# Altium project SML_Control_board.PrjPcb (part 2 of 2)

## Sheet Ethernet.SchDoc
size 420 x 297 mm; Address1: Address1; Address2: Address2; Address3: Address3; Address4: Address4; DocumentNumber: *Э3; SheetNumber: 13; SheetTotal: 15; DocumentType: Схема электрическая *
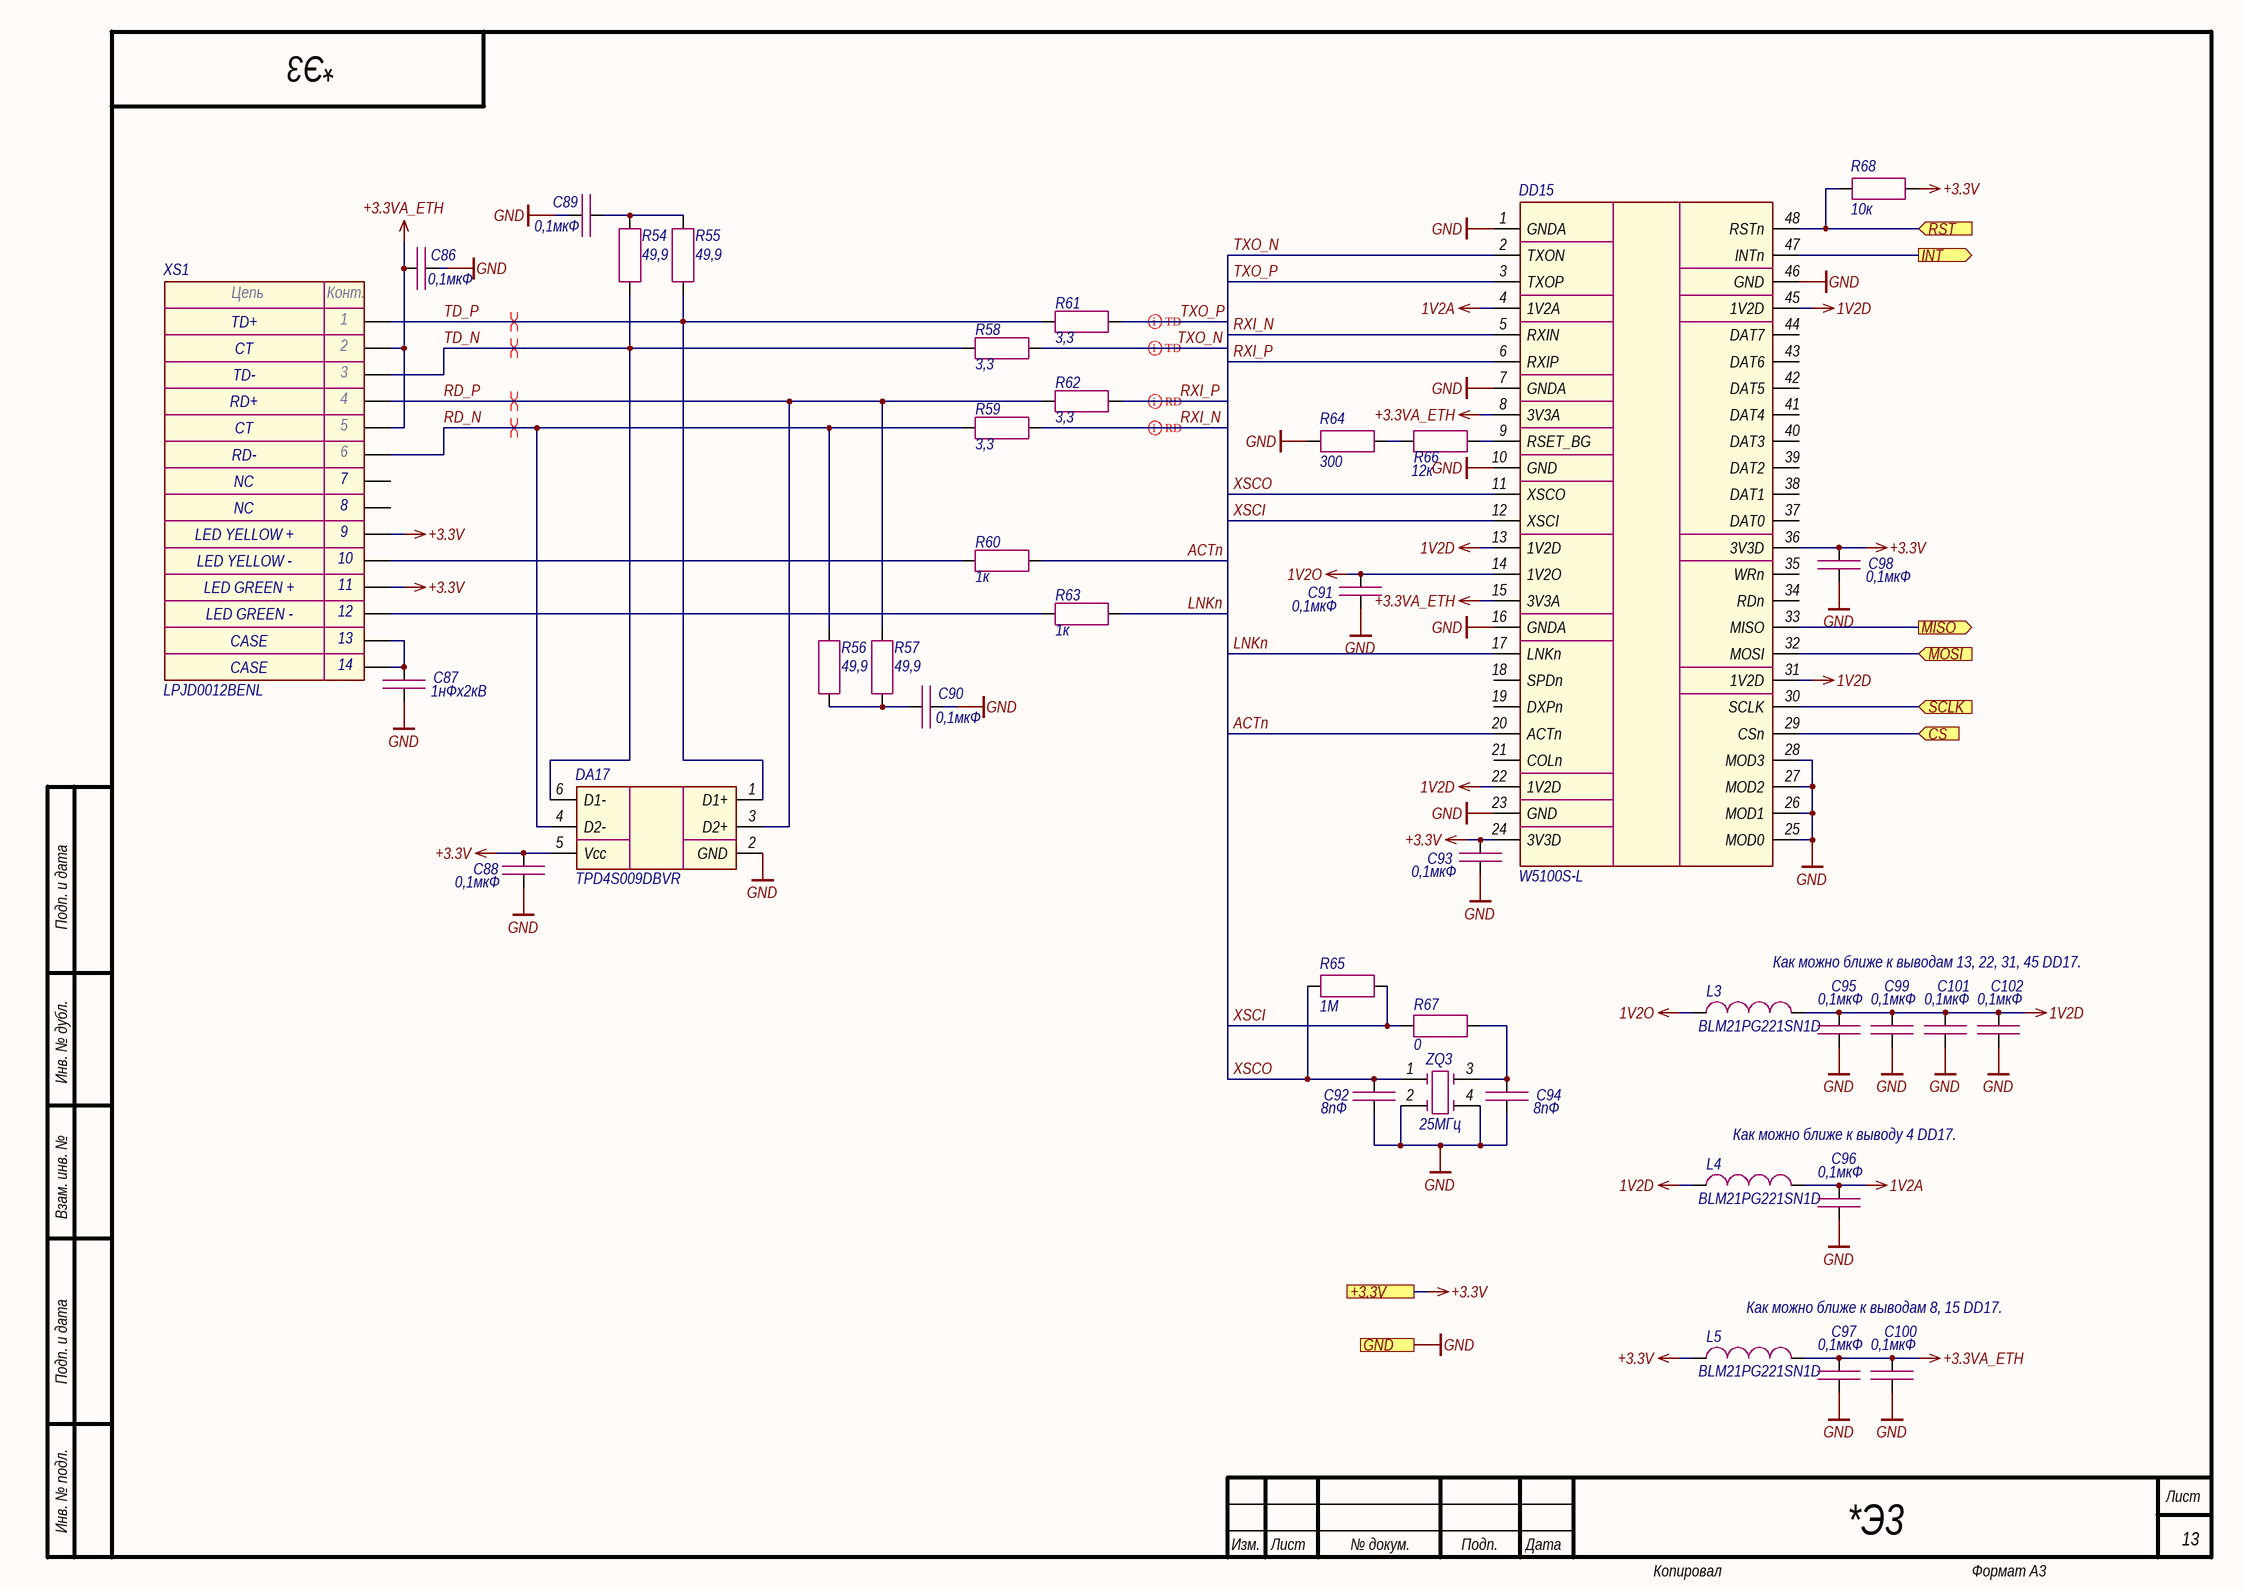
[diagram p12: Ethernet.SchDoc]

### Parts
C86  0,1мкФ  [CAP_0603]
C87  1нФх2кВ  [CAP_1206]
C88  0,1мкФ  [CAP_0603]
C89  0,1мкФ  [CAP_0603]
C90  0,1мкФ  [CAP_0603]
C91  0,1мкФ  [CAP_0603]
C92  8пФ  [CAP_0603]
C93  0,1мкФ  [CAP_0603]
C94  8пФ  [CAP_0603]
C95  0,1мкФ  [CAP_0603]
C96  0,1мкФ  [CAP_0603]
C97  0,1мкФ  [CAP_0603]
C98  0,1мкФ  [CAP_0603]
C99  0,1мкФ  [CAP_0603]
C100  0,1мкФ  [CAP_0603]
C101  0,1мкФ  [CAP_0603]
C102  0,1мкФ  [CAP_0603]
DA17  TPD4S009DBVR  [SOT-23-6]
DD15  W5100S-L  [LQFP-48]
L3  BLM21PG221SN1D  [IND_0805]
L4  BLM21PG221SN1D  [IND_0805]
L5  BLM21PG221SN1D  [IND_0805]
R54  49,9  [RES_0603]
R55  49,9  [RES_0603]
R56  49,9  [RES_0603]
R57  49,9  [RES_0603]
R58  3,3  [RES_0603]
R59  3,3  [RES_0603]
R60  1к  [RES_0603]
R61  3,3  [RES_0603]
R62  3,3  [RES_0603]
R63  1к  [RES_0603]
R64  300  [RES_0603]
R65  1М  [RES_0603]
R66  12к  [RES_0603]
R67  0  [RES_0603]
R68  10к  [RES_0603]
XS1  LPJD0012BENL  [LPJD0012BENL]
ZQ3  25МГц  [7M]

### Ports
+3.3V (see Main[1C], Button[1D], Fiber_interlock[2C], Flow_sensor[2C], Hardwiring[3D], LD_driver[1D], Power_supply[1D], Power_supply_CAN[1D], SF_driver[2C]), CS (in, see Main[1C]), GND (see Main[1C], Button[1D], Column[1C], Fiber_interlock[2C], Flow_sensor[2C], Guide_laser[1C], Hardwiring[3D], Indication[1C], LD_driver[1D], Power_supply[1D], Power_supply_CAN[1D], SF_driver[2D]), INT (out, see Main[1C]), MISO (out, see Main[1C]), MOSI (in, see Main[1C]), RST (in, see Main[1C]), SCLK (in, see Main[1C])

### Nets
1V2A: C96.1 DD15.4(1V2A) L4.2
1V2D: C95.1 C99.1 C101.1 C102.1 DD15.13(1V2D) DD15.22(1V2D) DD15.31(1V2D) DD15.45(1V2D) L3.2 L4.1
1V2O: C91.1 DD15.14(1V2O) L3.1
+3.3V: C88.1 C93.1 C98.1 DA17.5(Vcc) DD15.24(3V3D) DD15.36(3V3D) L5.1 R68.2 XS1.9 XS1.11 ; port +3.3V
+3.3VA_ETH: C86.1 C97.1 C100.1 DD15.8(3V3A) DD15.15(3V3A) L5.2 XS1.2 XS1.5
GND: C86.2 C87.2 C88.2 C89.2 C90.2 C91.2 C92.2 C93.2 C94.2 C95.2 C96.2 C97.2 C98.2 C99.2 C100.2 C101.2 C102.2 DA17.2(GND) DD15.1(GNDA) DD15.7(GNDA) DD15.10(GND) DD15.16(GNDA) DD15.23(GND) DD15.25(MOD0) DD15.26(MOD1) DD15.27(MOD2) DD15.28(MOD3) DD15.46(GND) R64.1 ZQ3.2 ZQ3.4 ; port GND
ACTn: DD15.20(ACTn) R60.2
ETH_CS: DD15.29(CSn) ; port CS
ETH_INT: DD15.47(INTn) ; port INT
ETH_MISO: DD15.33(MISO) ; port MISO
ETH_MOSI: DD15.32(MOSI) ; port MOSI
ETH_RST: DD15.48(RSTn) R68.1 ; port RST
ETH_SCLK: DD15.30(SCLK) ; port SCLK
LNKn: DD15.17(LNKn) R63.2
RD_N: DA17.4(D2-) R56.1 R59.2 XS1.6
RD_P: DA17.3(D2+) R57.1 R62.2 XS1.4
RXI_N: DD15.5(RXIN) R59.1
RXI_P: DD15.6(RXIP) R62.1
TD_N: DA17.6(D1-) R54.1 R58.2 XS1.3
TD_P: DA17.1(D1+) R55.1 R61.2 XS1.1
TXO_N: DD15.2(TXON) R58.1
TXO_P: DD15.3(TXOP) R61.1
XSCI: DD15.12(XSCI) R65.2 R67.1
XSCO: C92.1 DD15.11(XSCO) R65.1 ZQ3.1
NetC87_1: C87.1 XS1.13 XS1.14
NetC89_1: C89.1 R54.2 R55.2
NetC90_1: C90.1 R56.2 R57.2
NetC94_1: C94.1 R67.2 ZQ3.3
NetDD15_9: DD15.9(RSET_BG) R66.2
NetR60_1: R60.1 XS1.10
NetR63_1: R63.1 XS1.12
NetR64_2: R64.2 R66.1

Not connected (* = marked no-connect by the designer): DD15 18(SPDn) 19(DXPn) 21(COLn) 34(RDn) 35(WRn) 37(DAT0) 38(DAT1) 39(DAT2) 40(DAT3) 41(DAT4) 42(DAT5) 43(DAT6) 44(DAT7); XS1 7 8

### Layout directives
differential pair; differential pair class TD: TXO_N, TXO_P
differential pair; differential pair class RD: RXI_N, RXI_P
differential pair: RD_N, RD_P, TD_N, TD_P

### Notes on the sheet
- Как можно ближе к выводам 13, 22, 31, 45 DD17.
- Как можно ближе к выводу 4 DD17.
- Как можно ближе к выводам 8, 15 DD17.
- Подп. и дата
- Инв. № дубл.
- Взам. инв. №
- Инв. № подл.
- Изм.
- Лист
- № докум.
- Подп.
- Дата
- Копировал
- Формат А3
- (in symbol LPJD0012BENL) Цепь; Конт.; TD+; CT; TD-; RD+; RD-; NC; LED YELLOW +; LED YELLOW -; LED GREEN +; LED GREEN -; CASE

### Library data of the parts
C86 C88-C91 C93 C95-C102 = Capacitor: as C3 on sheet Main; Value: 0,1мкФ; Document: *
C87 = Capacitor: Manufacturer: Yageo; Model: CC1206KKX7RDBB102; Value: 1нФх2кВ; Document: *
C92 C94 = Capacitor: Manufacturer: Yageo; Model: CC0603CRNPO9BN8R0; Value: 8пФ; Document: *
DA17 = TPD4S009: Manufacturer: Texas Instruments; Model: TPD4S009DBVR; Document: *
DD15 = W5100S: Manufacturer: Wiznet; Model: W5100S-L; Document: *
L3-L5 = Inductor: Manufacturer: Murata; Value: *; Model: BLM21PG221SN1D; Document: *
R54-R57 = Resistor: Manufacturer: Yageo; Model: RC0603FR-0749R9L; Value: 49,9; Document: *
R58 R59 R61 R62 = Resistor: Manufacturer: Yageo; Model: RC0603FR-073R3L; Value: 3,3; Document: *
R60 R63 = Resistor: Manufacturer: Yageo; Model: RC0603FR-071KL; Value: 1к; Document: *
R64 = Resistor: Manufacturer: Yageo; Model: RC0603FR-07300RL; Value: 300; Document: *
R65 = Resistor: Manufacturer: Yageo; Model: RC0603FR-071ML; Value: 1М; Document: *
R66 = Resistor: Manufacturer: Yageo; Model: RC0603FR-0712KL; Value: 12к; Document: *
R67 = Resistor: Manufacturer: Yageo; Model: RC0603JR-070RL; Value: 0; Document: *
R68 = Resistor: as R3 on sheet Main; Value: 10к; Document: *
XS1 = LPJD0012BENL: Manufacturer: LINK-PP; Model: LPJD0012BENL; Document: *
ZQ3 = Quartz_Resonator_4-pin: Manufacturer: TXC; Model: 7M-25.000MAAJ-T; Value: 25МГц; Document: *

## Sheet Hardwiring.SchDoc
size 594 x 420 mm; Address1: Address1; Address2: Address2; Address3: Address3; Address4: Address4; DocumentNumber: *Э3; SheetNumber: 14; SheetTotal: 15; DocumentType: Схема электрическая *
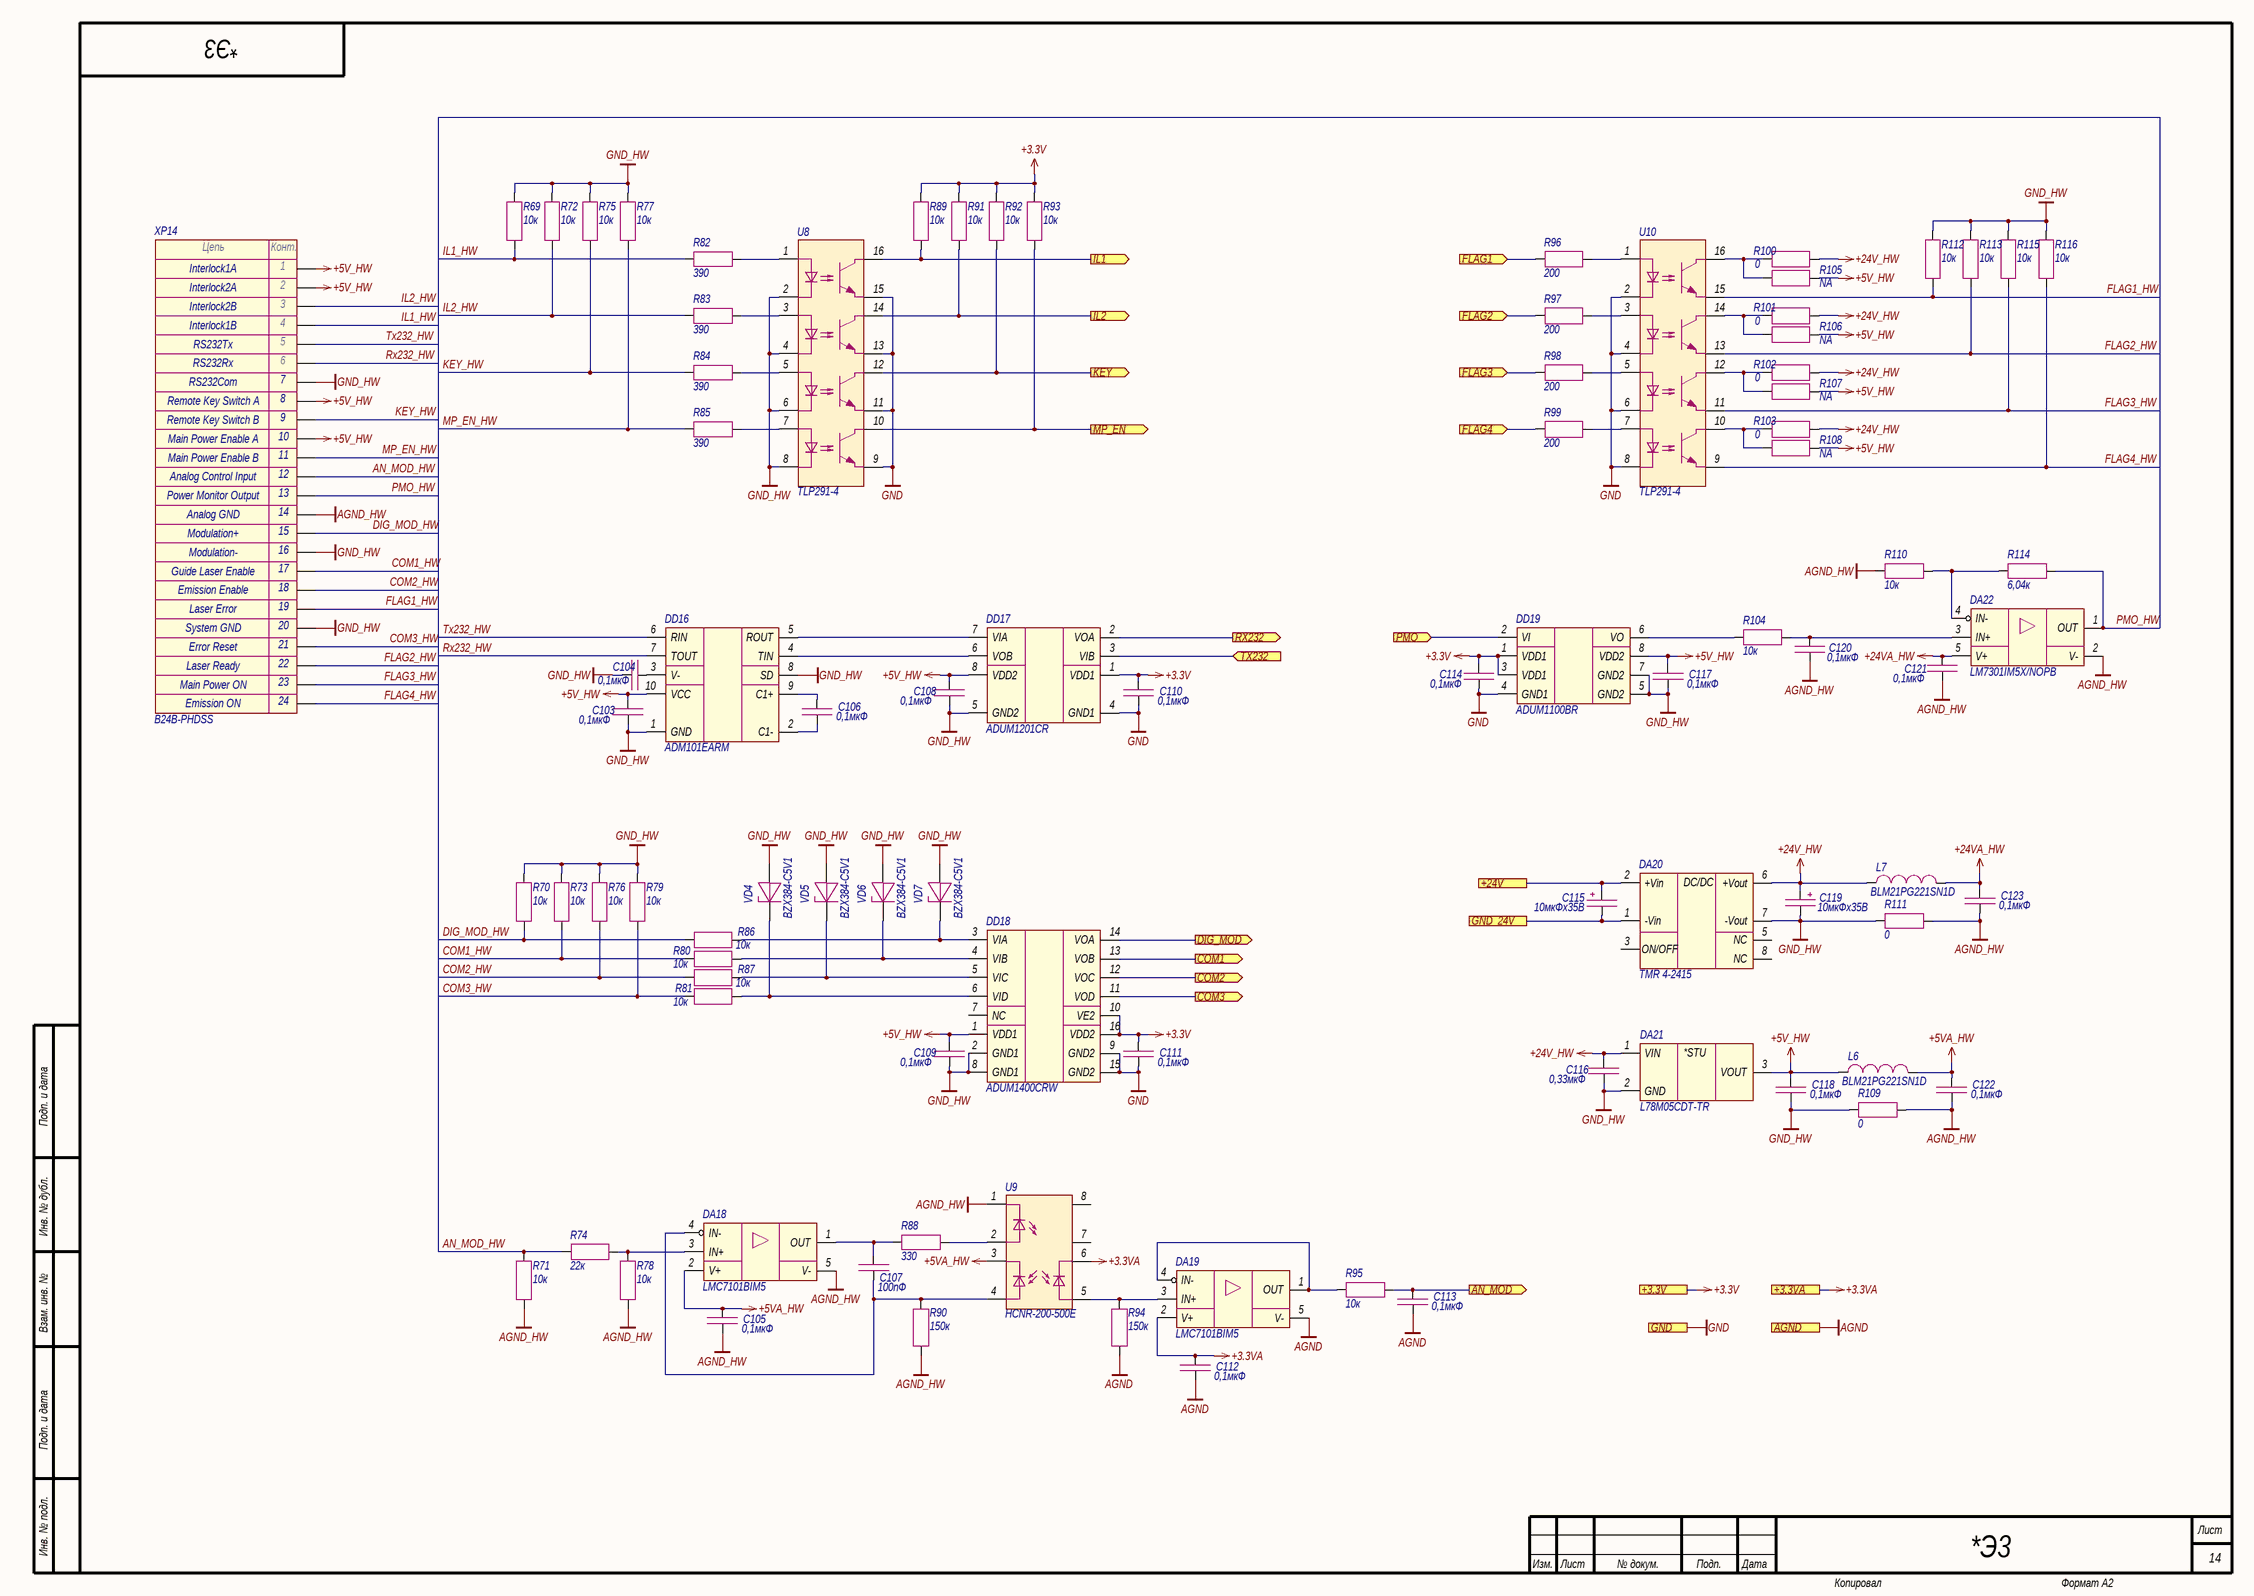
[diagram p13: Hardwiring.SchDoc]

### Parts
C103  0,1мкФ  [CAP_0603]
C104  0,1мкФ  [CAP_0603]
C105  0,1мкФ  [CAP_0603]
C106  0,1мкФ  [CAP_0603]
C107  100пФ  [CAP_0603]
C108  0,1мкФ  [CAP_0603]
C109  0,1мкФ  [CAP_0603]
C110  0,1мкФ  [CAP_0603]
C111  0,1мкФ  [CAP_0603]
C112  0,1мкФ  [CAP_0603]
C113  0,1мкФ  [CAP_0603]
C114  0,1мкФ  [CAP_0603]
C115  10мкФх35B  [CAP_C]
C116  0,33мкФ  [CAP_0805]
C117  0,1мкФ  [CAP_0603]
C118  0,1мкФ  [CAP_0603]
C119  10мкФх35B  [CAP_C]
C120  0,1мкФ  [CAP_0603]
C121  0,1мкФ  [CAP_0603]
C122  0,1мкФ  [CAP_0603]
C123  0,1мкФ  [CAP_0603]
DA18  LMC7101BIM5  [SOT-23-5]
DA19  LMC7101BIM5  [SOT-23-5]
DA20  TMR 4-2415  [TMR4 (SIP-8)]
DA21  L78M05CDT-TR  [TO-252]
DA22  LM7301IM5X/NOPB  [SOT-23-5]
DD16  ADM101EARM  [MSOP-10]
DD17  ADUM1201CR  [SOIC-8]
DD18  ADUM1400CRW  [SOIC-16W]
DD19  ADUM1100BR  [SOIC-8]
L6  BLM21PG221SN1D  [IND_0805]
L7  BLM21PG221SN1D  [IND_0805]
R69  10к  [RES_0603]
R70  10к  [RES_0603]
R71  10к  [RES_0603]
R72  10к  [RES_0603]
R73  10к  [RES_0603]
R74  22к  [RES_0603]
R75  10к  [RES_0603]
R76  10к  [RES_0603]
R77  10к  [RES_0603]
R78  10к  [RES_0603]
R79  10к  [RES_0603]
R80  10к  [RES_0603]
R81  10к  [RES_0603]
R82  390  [RES_0603]
R83  390  [RES_0603]
R84  390  [RES_0603]
R85  390  [RES_0603]
R86  10к  [RES_0603]
R87  10к  [RES_0603]
R88  330  [RES_0603]
R89  10к  [RES_0603]
R90  150к  [RES_0603]
R91  10к  [RES_0603]
R92  10к  [RES_0603]
R93  10к  [RES_0603]
R94  150к  [RES_0603]
R95  10к  [RES_0603]
R96  200  [RES_0603]
R97  200  [RES_0603]
R98  200  [RES_0603]
R99  200  [RES_0603]
R100  0  [RES_0603]
R101  0  [RES_0603]
R102  0  [RES_0603]
R103  0  [RES_0603]
R104  10к  [RES_0603]
R105  NA  [RES_0603]
R106  NA  [RES_0603]
R107  NA  [RES_0603]
R108  NA  [RES_0603]
R109  0  [RES_0805]
R110  10к  [RES_0603]
R111  0  [RES_0805]
R112  10к  [RES_0603]
R113  10к  [RES_0603]
R114  6,04к  [RES_0603]
R115  10к  [RES_0603]
R116  10к  [RES_0603]
U8  TLP291-4  [SOP-16]
U9  HCNR-200-500E  [HCNR200]
U10  TLP291-4  [SOP-16]
VD4  BZX384-C5V1  [SOD-323]
VD5  BZX384-C5V1  [SOD-323]
VD6  BZX384-C5V1  [SOD-323]
VD7  BZX384-C5V1  [SOD-323]
XP14  B24B-PHDSS  [B24B-PHDSS]

### Ports
+3.3V (see Main[1D], Button[1D], Ethernet[3D], Fiber_interlock[2C], Flow_sensor[2C], LD_driver[1D], Power_supply[1D], Power_supply_CAN[1D], SF_driver[2C]), +3.3VA (see Main[1D], Photodiode[1C], Thermistor[2C]), +24V (see Main[1D], Button[1C], Column[1C], Flow_sensor[2C], Indication[1C], LD_driver[1C], Power_supply[1D], Power_supply_CAN[1D]), AGND (see Main[1D], Photodiode[1C], Thermistor[2C]), AN_MOD (out, see Main[1D]), COM1 (out, see Main[1D]), COM2 (out, see Main[1D]), COM3 (out, see Main[1D]), DIG_MOD (out, see Main[1C]), FLAG1 (in, see Main[1C]), FLAG2 (in, see Main[1C]), FLAG3 (in, see Main[1C]), FLAG4 (in, see Main[1C]), GND (see Main[1D], Button[1D], Column[1C], Ethernet[3D], Fiber_interlock[2C], Flow_sensor[2C], Guide_laser[1C], Indication[1C], LD_driver[1D], Power_supply[1D], Power_supply_CAN[1D], SF_driver[2D]), GND_24V (see Main[1D], Button[1D], Column[1C], Flow_sensor[2C], Indication[1C], LD_driver[1D], Power_supply[1D], Power_supply_CAN[1D]), IL1 (out, see Main[1C]), IL2 (out, see Main[1C]), KEY (out, see Main[1C]), MP_EN (out, see Main[1C]), PMO (in, see Main[1C]), RX232 (out, see Main[1D]), TX232 (in, see Main[1D])

### Nets
+3.3V: C110.1 C111.1 C114.1 DD17.1(VDD1) DD18.10(VE2) DD18.16(VDD2) DD19.1(VDD1) DD19.3(VDD1) R89.1 R91.1 R92.1 R93.1 ; port +3.3V
+3.3VA: C112.1 DA19.2(V+) U9.6 ; port +3.3VA
+5V_HW: C103.1 C108.1 C109.1 C117.1 C118.1 DA21.3(VOUT) DD16.10(VCC) DD17.8(VDD2) DD18.1(VDD1) DD19.8(VDD2) L6.1 R105.2 R106.2 R107.2 R108.2 XP14.1 XP14.2 XP14.8 XP14.10
+5VA_HW: C105.1 C122.1 DA18.2(V+) L6.2 U9.3
+24V: C115.1 DA20.2(+Vin) ; port +24V
+24V_HW: C116.2 C119.1 DA20.6(+Vout) DA21.1(VIN) L7.1 R100.2 R101.2 R102.2 R103.2
+24VA_HW: C121.1 C123.1 DA22.5(V+) L7.2
AGND: C112.2 C113.2 DA19.5(V-) R94.2 ; port AGND
AGND_HW: C105.2 C120.2 C121.2 C122.2 C123.2 DA18.5(V-) DA22.2(V-) R71.2 R78.2 R90.2 R109.2 R110.1 R111.2 U9.1 XP14.14
GND: C110.2 C111.2 C114.2 DD17.4(GND1) DD18.9(GND2) DD18.15(GND2) DD19.4(GND1) U8.9 U8.11 U8.13 U8.15 U10.2 U10.4 U10.6 U10.8 ; port GND
GND_24V: C115.2 DA20.1(-Vin) ; port GND_24V
GND_HW: C103.2 C104.2 C108.2 C109.2 C116.1 C117.2 C118.2 C119.2 DA20.7(-Vout) DA21.2(GND) DD16.1(GND) DD16.8(SD) DD17.5(GND2) DD18.2(GND1) DD18.8(GND1) DD19.5(GND2) DD19.7(GND2) R69.1 R70.1 R72.1 R73.1 R75.1 R76.1 R77.1 R79.1 R109.1 R111.1 R112.1 R113.1 R115.1 R116.1 U8.2 U8.4 U8.6 U8.8 VD4.2(A) VD5.2(A) VD6.2(A) VD7.2(A) XP14.7 XP14.16 XP14.20
AN_MOD_HW: R71.1 R74.1 XP14.12
COM1_HW: R73.2 R80.1 XP14.17
COM2_HW: R76.2 R87.1 XP14.18
COM3_HW: R79.2 R81.1 XP14.21
DIG_MOD_HW: R70.2 R86.1 XP14.15
EXT_AN_MOD: C113.1 R95.2 ; port AN_MOD
EXT_COM1: DD18.13(VOB) ; port COM1
EXT_COM2: DD18.12(VOC) ; port COM2
EXT_COM3: DD18.11(VOD) ; port COM3
EXT_DIG_MOD: DD18.14(VOA) ; port DIG_MOD
EXT_FLAG1: R96.2 ; port FLAG1
EXT_FLAG2: R97.2 ; port FLAG2
EXT_FLAG3: R98.2 ; port FLAG3
EXT_FLAG4: R99.2 ; port FLAG4
EXT_IL1: R89.2 U8.16 ; port IL1
EXT_IL2: R91.2 U8.14 ; port IL2
EXT_KEY: R92.2 U8.12 ; port KEY
EXT_MP_EN: R93.2 U8.10 ; port MP_EN
EXT_PMO: DD19.2(VI) ; port PMO
FLAG1_HW: R112.2 U10.15 XP14.19
FLAG2_HW: R113.2 U10.13 XP14.22
FLAG3_HW: R115.2 U10.11 XP14.23
FLAG4_HW: R116.2 U10.9 XP14.24
IL1_HW: R69.2 R82.1 XP14.4
IL2_HW: R72.2 R83.1 XP14.3
KEY_HW: R75.2 R84.1 XP14.9
MP_EN_HW: R77.2 R85.1 XP14.11
PMO_HW: DA22.1(OUT) R114.2 XP14.13
Rx232: DD17.2(VOA) ; port RX232
Rx232_HW: DD16.7(TOUT) XP14.6
Tx232: DD17.3(VIB) ; port TX232
Tx232_HW: DD16.6(RIN) XP14.5
NetC104_1: C104.1 DD16.3(V-)
NetC106_1: C106.1 DD16.9(C1+)
NetC106_2: C106.2 DD16.2(C1-)
NetC107_1: C107.1 DA18.1(OUT) R88.1
NetC107_2: C107.2 DA18.4(IN-) R90.1 U9.4
NetC120_1: C120.1 DA22.3(IN+) R104.2
NetDA18_3: DA18.3(IN+) R74.2 R78.1
NetDA19_1: DA19.1(OUT) DA19.4(IN-) R95.1
NetDA19_3: DA19.3(IN+) R94.1 U9.5
NetDA22_4: DA22.4(IN-) R110.2 R114.1
NetDD16_4: DD16.4(TIN) DD17.6(VOB)
NetDD16_5: DD16.5(ROUT) DD17.7(VIA)
NetDD18_3: DD18.3(VIA) R86.2 VD7.1(K)
NetDD18_4: DD18.4(VIB) R80.2 VD6.1(K)
NetDD18_5: DD18.5(VIC) R87.2 VD5.1(K)
NetDD18_6: DD18.6(VID) R81.2 VD4.1(K)
NetDD19_6: DD19.6(VO) R104.1
NetR82_2: R82.2 U8.1
NetR83_2: R83.2 U8.3
NetR84_2: R84.2 U8.5
NetR85_2: R85.2 U8.7
NetR88_2: R88.2 U9.2
NetR96_1: R96.1 U10.1
NetR97_1: R97.1 U10.3
NetR98_1: R98.1 U10.5
NetR99_1: R99.1 U10.7
NetR100_1: R100.1 R105.1 U10.16
NetR101_1: R101.1 R106.1 U10.14
NetR102_1: R102.1 R107.1 U10.12
NetR103_1: R103.1 R108.1 U10.10

Not connected (* = marked no-connect by the designer): DA20 3(ON/OFF) 5(NC) 8(NC); DD18 7(NC); U9 7 8

### Notes on the sheet
- Interlock1A
- Interlock2A
- Interlock2B
- Interlock1B
- RS232Tx
- RS232Rx
- RS232Com
- (near XP14) Remote Key Switch A
- (near XP14) Remote Key Switch B
- (near XP14) Main Power Enable A
- (near XP14) Main Power Enable B
- (near XP14) Analog Control Input
- (near XP14) Power Monitor Output
- Analog GND
- Modulation+
- Modulation-
- (near XP14) Guide Laser Enable
- (near XP14) Emission Enable
- System GND
- Error Reset
- Laser Error
- Main Power ON
- Emission ON
- Laser Ready
- Подп. и дата
- Инв. № дубл.
- Взам. инв. №
- Инв. № подл.
- Изм.
- Лист
- № докум.
- Подп.
- Дата
- Копировал
- Формат А2
- (in symbol Connector-24) Цепь; Конт.
- (in symbol L78M) *STU
- (in symbol TMR4) DC/DC

### Library data of the parts
C103-C106 C108-C114 C117 C118 C120-C123 = Capacitor: Manufacturer: Murata; Model: GRM188R71H104KA93D; Value: 0,1мкФ; Document: *
C107 = Capacitor: Manufacturer: Murata; Model: GRM1885C1H101JA01D; Value: 100пФ; Document: *
C115 C119 = Capacitor_Polar: Model: TECAP, 10 мкФ, 35 В, тип C, 10%; Value: 10мкФх35B; Document: *; Manufacturer: *
C116 = Capacitor: Manufacturer: Murata; Model: GRM219R71H334KA88D; Value: 0,33мкФ; Document: *
DA18 DA19 = LMC7101: Manufacturer: Texas Instruments; Model: LMC7101BIM5; Document: *
DA20 = TMR4: Manufacturer: Traco Power; Model: TMR 4-2415; Document: *
DA21 = L78M: Manufacturer: STMicroelectronics; Model: L78M05CDT-TR; Document: *
DA22 = LM7301IM5: Manufacturer: Texas Instruments; Model: LM7301IM5X/NOPB; Document: *
DD16 = ADM101EARM: Manufacturer: Analog Devices; Model: ADM101EARM; Document: *
DD17 = ADUM1201: Manufacturer: Analog Devices; Model: ADUM1201CR; Document: *
DD18 = ADUM1400: Manufacturer: Analog Devices; Model: ADUM1400CRW; Document: *
DD19 = ADUM1100: Manufacturer: Analog Devices; Model: ADUM1100BR; Document: *
L6 L7 = Inductor: Manufacturer: Murata; Value: *; Model: BLM21PG221SN1D; Document: *
R69-R73 R75-R81 R86 R87 R89 R91-R93 R95 R104 R110 R112 R113 R115 R116 = Resistor: Manufacturer: Yageo; Model: RC0603FR-0710KL; Value: 10к; Document: *
R74 = Resistor: Manufacturer: Yageo; Model: RC0603FR-0722KL; Value: 22к; Document: *
R82-R85 = Resistor: Manufacturer: Yageo; Model: RC0603FR-07390RL; Value: 390; Document: *
R88 = Resistor: Manufacturer: Yageo; Model: RC0603FR-07330RL; Value: 330; Document: *
R90 R94 = Resistor: Manufacturer: Yageo; Model: RC0603FR-07150KL; Value: 150к; Document: *
R96-R99 = Resistor: Manufacturer: Yageo; Model: RC0603FR-07200RL; Value: 200; Document: *
R100-R103 = Resistor: Manufacturer: Yageo; Model: RC0603FR-070RL; Value: 0; Document: *
R105-R108 = Resistor: Value: NA; Model: *; Document: *; Manufacturer: *
R109 R111 = Resistor: Manufacturer: Yageo; Model: RC0805FR-070RL; Value: 0; Document: *
R114 = Resistor: Manufacturer: Yageo; Model: RC0603FR-076K04L; Value: 6,04к; Document: *
U8 U10 = TLP281-4: Manufacturer: Toshiba; Model: TLP291-4; Document: *
U9 = HCNR200: Manufacturer: Avago; Model: HCNR-200-500E; Document: *
VD4-VD7 = Diode_Zener: Manufacturer: Nexperia; Model: BZX384-C5V1; Document: *
XP14 = Connector-24: Manufacturer: JST; Model: B24B-PHDSS; Document: *

## Sheet SF_driver.SchDoc
size 420 x 297 mm; Address1: Address1; Address2: Address2; Address3: Address3; Address4: Address4; DocumentNumber: *Э3; SheetNumber: 15; SheetTotal: 15; DocumentType: Схема электрическая *
Used 2 times, as channels A25, A26. Parts and nets are listed once, with the designators drawn on the sheet.
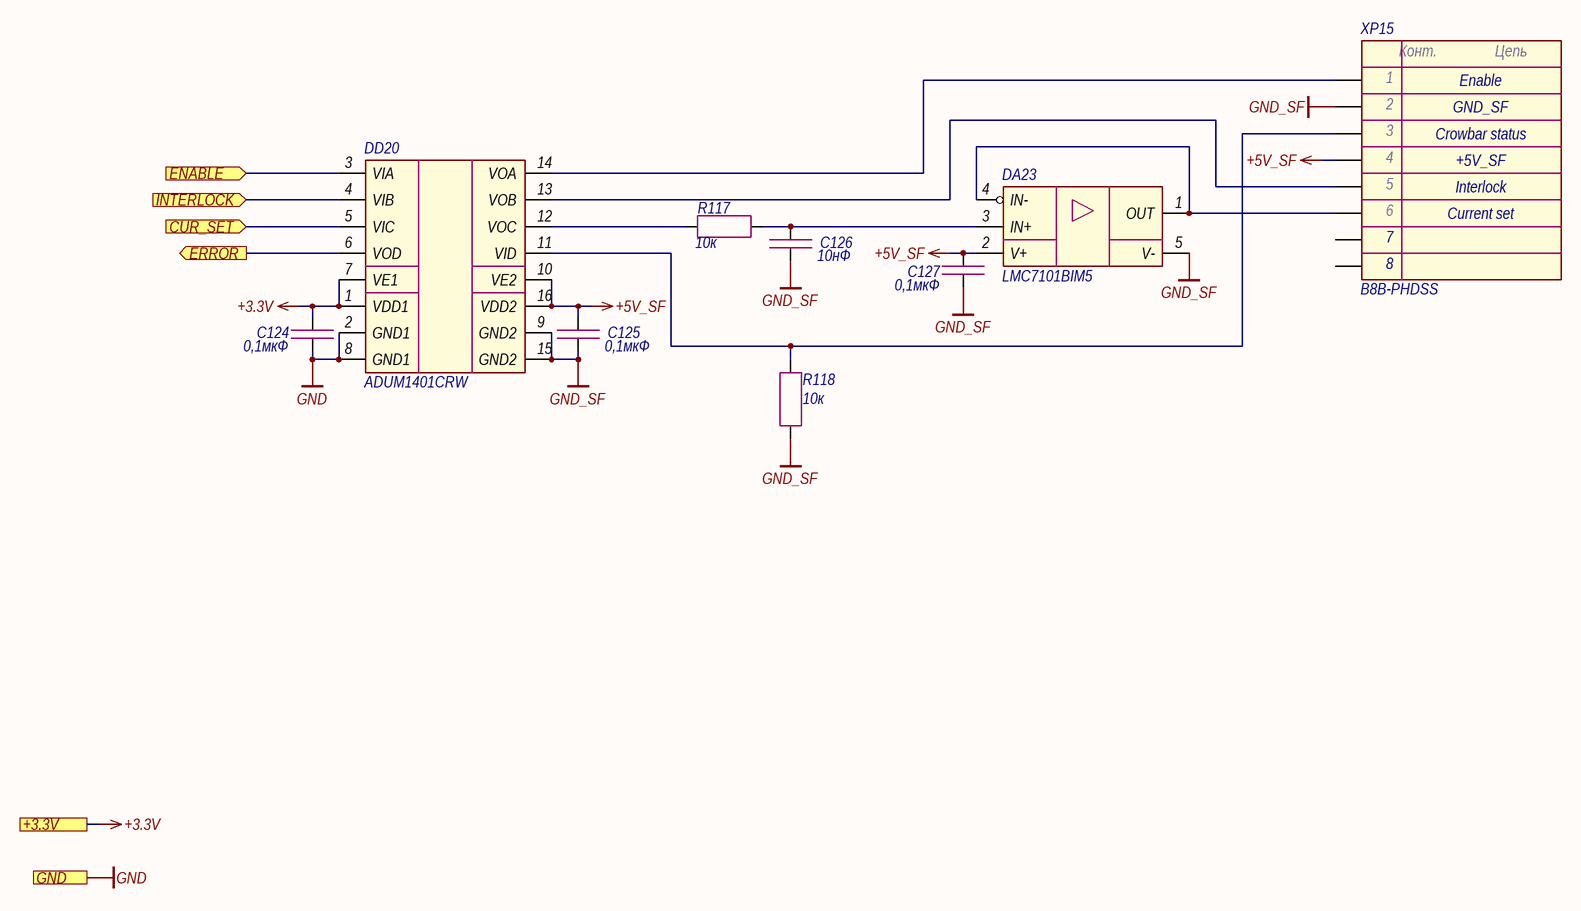
[diagram p14: SF_driver.SchDoc]

### Parts
C124  0,1мкФ  [CAP_0603]
C125  0,1мкФ  [CAP_0603]
C126  10нФ  [CAP_0603]
C127  0,1мкФ  [CAP_0603]
DA23  LMC7101BIM5  [SOT-23-5]
DD20  ADUM1401CRW  [SOIC-16W]
R117  10к  [RES_0603]
R118  10к  [RES_0603]
XP15  B8B-PHDSS  [B8B-PHDSS]

### Ports
+3.3V (see Main[1D], Button[1D], Ethernet[3D], Fiber_interlock[2C], Flow_sensor[2C], Hardwiring[3D], LD_driver[1D], Power_supply[1D], Power_supply_CAN[1D]), CUR_SET (in, see Main[1D]), ENABLE (in, see Main[1D]), ERROR (out, see Main[1D]), GND (see Main[1D], Button[1D], Column[1C], Ethernet[3D], Fiber_interlock[2C], Flow_sensor[2C], Guide_laser[1C], Hardwiring[3D], Indication[1C], LD_driver[1D], Power_supply[1D], Power_supply_CAN[1D]), INTERLOCK (in, see Main[1D])

### Nets
+3.3V: C124.1 DD20.1(VDD1) DD20.7(VE1) ; port +3.3V
+5V_SF: C125.1 C127.1 DA23.2(V+) DD20.10(VE2) DD20.16(VDD2) XP15.4
GND: C124.2 DD20.2(GND1) DD20.8(GND1) ; port GND
GND_SF: C125.2 C126.2 C127.2 DA23.5(V-) DD20.9(GND2) DD20.15(GND2) R118.1 XP15.2
CUR_SET: DD20.5(VIC) ; port CUR_SET
ENABLE: DD20.3(VIA) ; port ENABLE
ERROR: DD20.6(VOD) ; port ERROR
INTERLOCK: DD20.4(VIB) ; port INTERLOCK
NetC126_1: C126.1 DA23.3(IN+) R117.2
NetDA23_1: DA23.1(OUT) DA23.4(IN-) XP15.6
NetDD20_11: DD20.11(VID) R118.2 XP15.3
NetDD20_12: DD20.12(VOC) R117.1
NetDD20_13: DD20.13(VOB) XP15.5
NetDD20_14: DD20.14(VOA) XP15.1

Not connected (* = marked no-connect by the designer): XP15 7 8

### Channels
A25: designators end in A25; ports +3.3V=+3.3V CUR_SET=SF1_CUR_SET ENABLE=SF1_EN ERROR=SF1_ERR GND=GND INTERLOCK=SF1_IL
A26: designators end in A26; ports +3.3V=+3.3V CUR_SET=SF2_CUR_SET ENABLE=SF2_EN ERROR=SF2_ERR GND=GND INTERLOCK=SF2_IL

### Notes on the sheet
- Crowbar status
- Enable
- GND_SF
- Interlock
- +5V_SF
- Current set
- Подп. и дата
- Инв. № дубл.
- Взам. инв. №
- Инв. № подл.
- Изм.
- Лист
- № докум.
- Подп.
- Дата
- Копировал
- Формат А3
- (in symbol Connector-8) Конт.; Цепь

### Library data of the parts
C124 C125 C127 = Capacitor: as C103-C106 on sheet Hardwiring; Value: 0,1мкФ; Document: *
C126 = Capacitor: Manufacturer: Murata; Model: GRM188R71H103JA01D; Value: 10нФ; Document: *
DA23 = LMC7101: Manufacturer: Texas Instruments; Model: LMC7101BIM5; Document: *
DD20 = ADUM1401: Manufacturer: Analog Devices; Model: ADUM1401CRW; Document: *
R117 R118 = Resistor: as R69-R73 on sheet Hardwiring; Value: 10к; Document: *
XP15 = Connector-8: Manufacturer: JST; Model: B8B-PHDSS; Document: *

## Nets that join several sheets
+3.3V: Main (33 pins), A13 (6 pins), A14 (6 pins), A15 (6 pins), A16 (6 pins), Power_supply_CAN (8 pins), Power_supply (6 pins), Fiber_interlock (C43.1 DD3.5 R27.2), Button (9 pins), Flow_sensor (C85.1 DD14.8), Ethernet (10 pins), Hardwiring (12 pins), A25 (C124A25.1 DD20A25.1 DD20A25.7), A26 (C124A26.1 DD20A26.1 DD20A26.7)
+3.3VA: Main (6 pins), A1 (C35A1.1 C36A1.1 DA4A1.4 R16A1.3), A2 (C35A2.1 C36A2.1 DA4A2.4 R16A2.3), A3 (C35A3.1 C36A3.1 DA4A3.4 R16A3.3), A4 (C35A4.1 C36A4.1 DA4A4.4 R16A4.3), A5 (C35A5.1 C36A5.1 DA4A5.4 R16A5.3), A6 (C35A6.1 C36A6.1 DA4A6.4 R16A6.3), A7 (R17A7.1), A8 (R17A8.1), A9 (R17A9.1), A10 (R17A10.1), Hardwiring (C112.1 DA19.2 U9.6)
+5V: Main (5 pins), Guide_laser (5 pins)
+5VA: Main (C3.1 L1.2), A1 (C31A1.1 C32A1.1 DA3A1.7 DA3A1.8), A2 (C31A2.1 C32A2.1 DA3A2.7 DA3A2.8), A3 (C31A3.1 C32A3.1 DA3A3.7 DA3A3.8), A4 (C31A4.1 C32A4.1 DA3A4.7 DA3A4.8), A5 (C31A5.1 C32A5.1 DA3A5.7 DA3A5.8), A6 (C31A6.1 C32A6.1 DA3A6.7 DA3A6.8)
+24V: Main (C1.1 DA1.2 XP3.1), A13 (C44A13.1 DA8A13.2), A14 (C44A14.1 DA8A14.2), A15 (C44A15.1 DA8A15.2), A16 (C44A16.1 DA8A16.2), Power_supply_CAN (C55.1 DA11.2), Power_supply (C65.1 DA13.2), Button (C73.2 DA15.3), Indication (XP11.1 XP11.3 XP11.5), Column (XP12.1 XP12.3 XP12.5), Flow_sensor (C81.1 DA16.2), Hardwiring (C115.1 DA20.2)
AGND: Main (17 pins), A1 (15 pins), A2 (15 pins), A3 (15 pins), A4 (15 pins), A5 (15 pins), A6 (15 pins), A7 (C37A7.2), A8 (C37A8.2), A9 (C37A9.2), A10 (C37A10.2), Hardwiring (C112.2 C113.2 DA19.5 R94.2)
GND: Main (50 pins), Guide_laser (8 pins), A13 (8 pins), A14 (8 pins), A15 (8 pins), A16 (8 pins), Power_supply_CAN (9 pins), Power_supply (5 pins), Fiber_interlock (C42.2 C43.2 DD3.3 XP6.2), Button (13 pins), Indication (U2.2 U3.2 U4.2), Column (U5.3 U6.3 U7.3), Flow_sensor (C85.2 DD14.5 DD14.7), Ethernet (31 pins), Hardwiring (15 pins), A25 (C124A25.2 DD20A25.2 DD20A25.8), A26 (C124A26.2 DD20A26.2 DD20A26.8)
GND_24V: Main (C1.2 DA1.1 XP3.2), A13 (C44A13.2 DA8A13.1), A14 (C44A14.2 DA8A14.1), A15 (C44A15.2 DA8A15.1), A16 (C44A16.2 DA8A16.1), Power_supply_CAN (C55.2 DA11.1), Power_supply (C65.2 DA13.1), Button (C73.1 C74.2 DA15.2 U1.3), Indication (U2.3 U3.3 U4.3), Column (U5.4 U6.4 U7.4), Flow_sensor (C81.2 DA16.1), Hardwiring (C115.2 DA20.1)
CRASH_COL: Main (DD1.128), Column (R52.2)
CRASH_IND: Main (DD1.125), Indication (R49.2)
DRV1_AN_MOD: Main (DD1.96), A13 (DD4A13.5)
DRV1_DIG_MOD: Main (DD1.81), A13 (DA7A13.3)
DRV1_ERR1: Main (DD1.75), A13 (DD5A13.7)
DRV1_ERR2: Main (DD1.76), A13 (DD5A13.6)
DRV1_ON: Main (DD1.73), A13 (DD4A13.3)
DRV1_SEL_MOD: Main (DD1.74), A13 (DA7A13.6)
DRV2_AN_MOD: Main (DD1.97), A14 (DD4A14.5)
DRV2_DIG_MOD: Main (DD1.82), A14 (DA7A14.3)
DRV2_ERR1: Main (DD1.79), A14 (DD5A14.7)
DRV2_ERR2: Main (DD1.80), A14 (DD5A14.6)
DRV2_ON: Main (DD1.77), A14 (DD4A14.3)
DRV2_SEL_MOD: Main (DD1.78), A14 (DA7A14.6)
DRV3_AN_MOD: Main (DD1.98), A15 (DD4A15.5)
DRV3_DIG_MOD: Main (DD1.85), A15 (DA7A15.3)
DRV3_ERR1: Main (DD1.89), A15 (DD5A15.7)
DRV3_ERR2: Main (DD1.90), A15 (DD5A15.6)
DRV3_ON: Main (DD1.87), A15 (DD4A15.3)
DRV3_SEL_MOD: Main (DD1.88), A15 (DA7A15.6)
DRV4_AN_MOD: Main (DD1.99), A16 (DD4A16.5)
DRV4_DIG_MOD: Main (DD1.86), A16 (DA7A16.3)
DRV4_ERR1: Main (DD1.93), A16 (DD5A16.7)
DRV4_ERR2: Main (DD1.100), A16 (DD5A16.6)
DRV4_ON: Main (DD1.91), A16 (DD4A16.3)
DRV4_SEL_MOD: Main (DD1.92), A16 (DA7A16.6)
EMER_BUT: Main (DD1.117), Button (DD11.4)
EMIS_COL: Main (DD1.127), Column (R51.2)
EMIS_IND: Main (DD1.124), Indication (R48.2)
ETH_CS: Main (DD1.114), Ethernet (DD15.29)
ETH_INT: Main (DD1.116), Ethernet (DD15.47)
ETH_MISO: Main (DD1.112), Ethernet (DD15.33)
ETH_MOSI: Main (DD1.113), Ethernet (DD15.32)
ETH_RST: Main (DD1.115), Ethernet (DD15.48 R68.1)
ETH_SCLK: Main (DD1.111), Ethernet (DD15.30)
EXT_AN_MOD: Main (DD1.46), Hardwiring (C113.1 R95.2)
EXT_COM1: Main (DD1.57), Hardwiring (DD18.13)
EXT_COM2: Main (DD1.58), Hardwiring (DD18.12)
EXT_COM3: Main (DD1.59), Hardwiring (DD18.11)
EXT_DIG_MOD: Main (DD1.60), A13 (DA7A13.1), A14 (DA7A14.1), A15 (DA7A15.1), A16 (DA7A16.1), Hardwiring (DD18.14)
EXT_FLAG1: Main (DD1.66), Hardwiring (R96.2)
EXT_FLAG2: Main (DD1.65), Hardwiring (R97.2)
EXT_FLAG3: Main (DD1.64), Hardwiring (R98.2)
EXT_FLAG4: Main (DD1.63), Hardwiring (R99.2)
EXT_IL1: Main (DD1.53), Hardwiring (R89.2 U8.16)
EXT_IL2: Main (DD1.54), Hardwiring (R91.2 U8.14)
EXT_KEY: Main (DD1.55), Hardwiring (R92.2 U8.12)
EXT_MP_EN: Main (DD1.56), Hardwiring (R93.2 U8.10)
EXT_PMO: Main (DD1.47), Hardwiring (DD19.2)
FIBER_IL: Main (DD1.129), Fiber_interlock (DD3.4)
FLOW: Main (DD1.110), Flow_sensor (DD14.6)
GUIDE_LAS: Main (DD1.20), Guide_laser (R19.1)
KEY: Main (DD1.118), Button (DD12.4)
PD1: Main (XP1.1), A1 (C30A1.2 DA3A1.2 R10A1.2)
PD1_ADC: Main (DD1.37), A1 (C33A1.1 R13A1.2)
PD1_ERR: Main (DD1.22), A1 (DA4A1.5)
PD2: Main (XP1.3), A4 (C30A4.2 DA3A4.2 R10A4.2)
PD2_ADC: Main (DD1.34), A4 (C33A4.1 R13A4.2)
PD2_ERR: Main (DD1.21), A4 (DA4A4.5)
PD3: Main (XP1.5), A2 (C30A2.2 DA3A2.2 R10A2.2)
PD3_ADC: Main (DD1.40), A2 (C33A2.1 R13A2.2)
PD3_ERR: Main (DD1.27), A2 (DA4A2.5)
PD4: Main (XP1.7), A5 (C30A5.2 DA3A5.2 R10A5.2)
PD4_ADC: Main (DD1.35), A5 (C33A5.1 R13A5.2)
PD4_ERR: Main (DD1.26), A5 (DA4A5.5)
PD5: Main (XP1.9), A3 (C30A3.2 DA3A3.2 R10A3.2)
PD5_ADC: Main (DD1.41), A3 (C33A3.1 R13A3.2)
PD5_ERR: Main (DD1.29), A3 (DA4A3.5)
PD6: Main (XP1.11), A6 (C30A6.2 DA3A6.2 R10A6.2)
PD6_ADC: Main (DD1.36), A6 (C33A6.1 R13A6.2)
PD6_ERR: Main (DD1.28), A6 (DA4A6.5)
POWER_COL: Main (DD1.126), Column (R50.2)
POWER_IND: Main (DD1.123), Indication (R47.2)
PS1_ERR1: Main (DD1.137), Power_supply_CAN (DD6.14)
PS1_ERR2: Main (DD1.141), Power_supply_CAN (DD6.13)
PS1_ERR3: Main (DD1.142), Power_supply_CAN (DD6.12)
PS1_ON: Main (DD1.132), Power_supply_CAN (DD6.11)
PS1_PV: Main (DD1.4), Power_supply_CAN (DD7.2)
PS2_ERR1: Main (DD1.2), Power_supply (DD9.14)
PS2_ERR2: Main (DD1.3), Power_supply (DD9.13)
PS2_ERR3: Main (DD1.7), Power_supply (DD9.12)
PS2_ON: Main (DD1.1), Power_supply (DD9.11)
PS2_PV: Main (DD1.5), Power_supply (DD10.2)
Rx232: Main (DD1.70), Hardwiring (DD17.2)
RxCAN: Main (DD1.139), Power_supply_CAN (DD8.5)
SF1_CUR_SET: Main (DD1.18), A25 (DD20A25.5)
SF1_EN: Main (DD1.10), A25 (DD20A25.3)
SF1_ERR: Main (DD1.12), A25 (DD20A25.6)
SF1_IL: Main (DD1.11), A25 (DD20A25.4)
SF2_CUR_SET: Main (DD1.19), A26 (DD20A26.5)
SF2_EN: Main (DD1.13), A26 (DD20A26.3)
SF2_ERR: Main (DD1.15), A26 (DD20A26.6)
SF2_IL: Main (DD1.14), A26 (DD20A26.4)
START_BUT: Main (DD1.119), Button (DD13.4)
START_IND: Main (DD1.122), Button (R46.2)
T1: Main (XP2.1), A7 (R17A7.2 R18A7.1)
T1_ADC: Main (DD1.42), A7 (C37A7.1 R18A7.2)
T2: Main (XP2.3), A8 (R17A8.2 R18A8.1)
T2_ADC: Main (DD1.43), A8 (C37A8.1 R18A8.2)
T3: Main (XP2.5), A9 (R17A9.2 R18A9.1)
T3_ADC: Main (DD1.44), A9 (C37A9.1 R18A9.2)
T4: Main (XP2.7), A10 (R17A10.2 R18A10.1)
T4_ADC: Main (DD1.45), A10 (C37A10.1 R18A10.2)
Tx232: Main (DD1.69), Hardwiring (DD17.3)
TxCAN: Main (DD1.140), Power_supply_CAN (DD8.6)